# Altium schematic sheet PROC106B_HD_CONN_PWR_SW.SchDoc: BREAKAWAY_60PIN_CONN
size 431 x 279 mm; Date: Not shown in title block; ApprovedBy: Not shown in title block; CheckedBy: Not shown in title block; Author: Not shown in title block; CompanyName: Not shown in title block; DrawnBy: Antony/Anand Ram; Engineer: Not shown in title block; Organization: Not shown in title block; Address1: Not shown in title block; Address2: Not shown in title block; Address3: Not shown in title block; Address4: Not shown in title block; DocumentNumber: 7; Revision: Use project parameter SCH_Rev; SheetNumber: 7; SheetTotal: 12; PageSetup: Record=PageOptions|CenterHorizontal=True|CenterVertical=True|PrintScale=1.00|XCorrection=1.00|YCorrection=1.00|PrintKind=0|BorderSize=5000000|LeftOffset=0|BottomOffset=0|Orientation=2|PaperLength=1000|PaperWidth=1000|Scale=100|PaperSource=15|PrintQuality=600|MediaType=1|DitherType=10|PaperKind=Letter|PrintScaleMode=1; CurrentTime: Not shown in title block; CurrentDate: Not shown in title block; Time: Not shown in title block; DocumentFullPathAndName: Not shown in title block; DocumentName: Not shown in title block; ModifiedDate: Not shown in title block; ImagePath: Not shown in title block
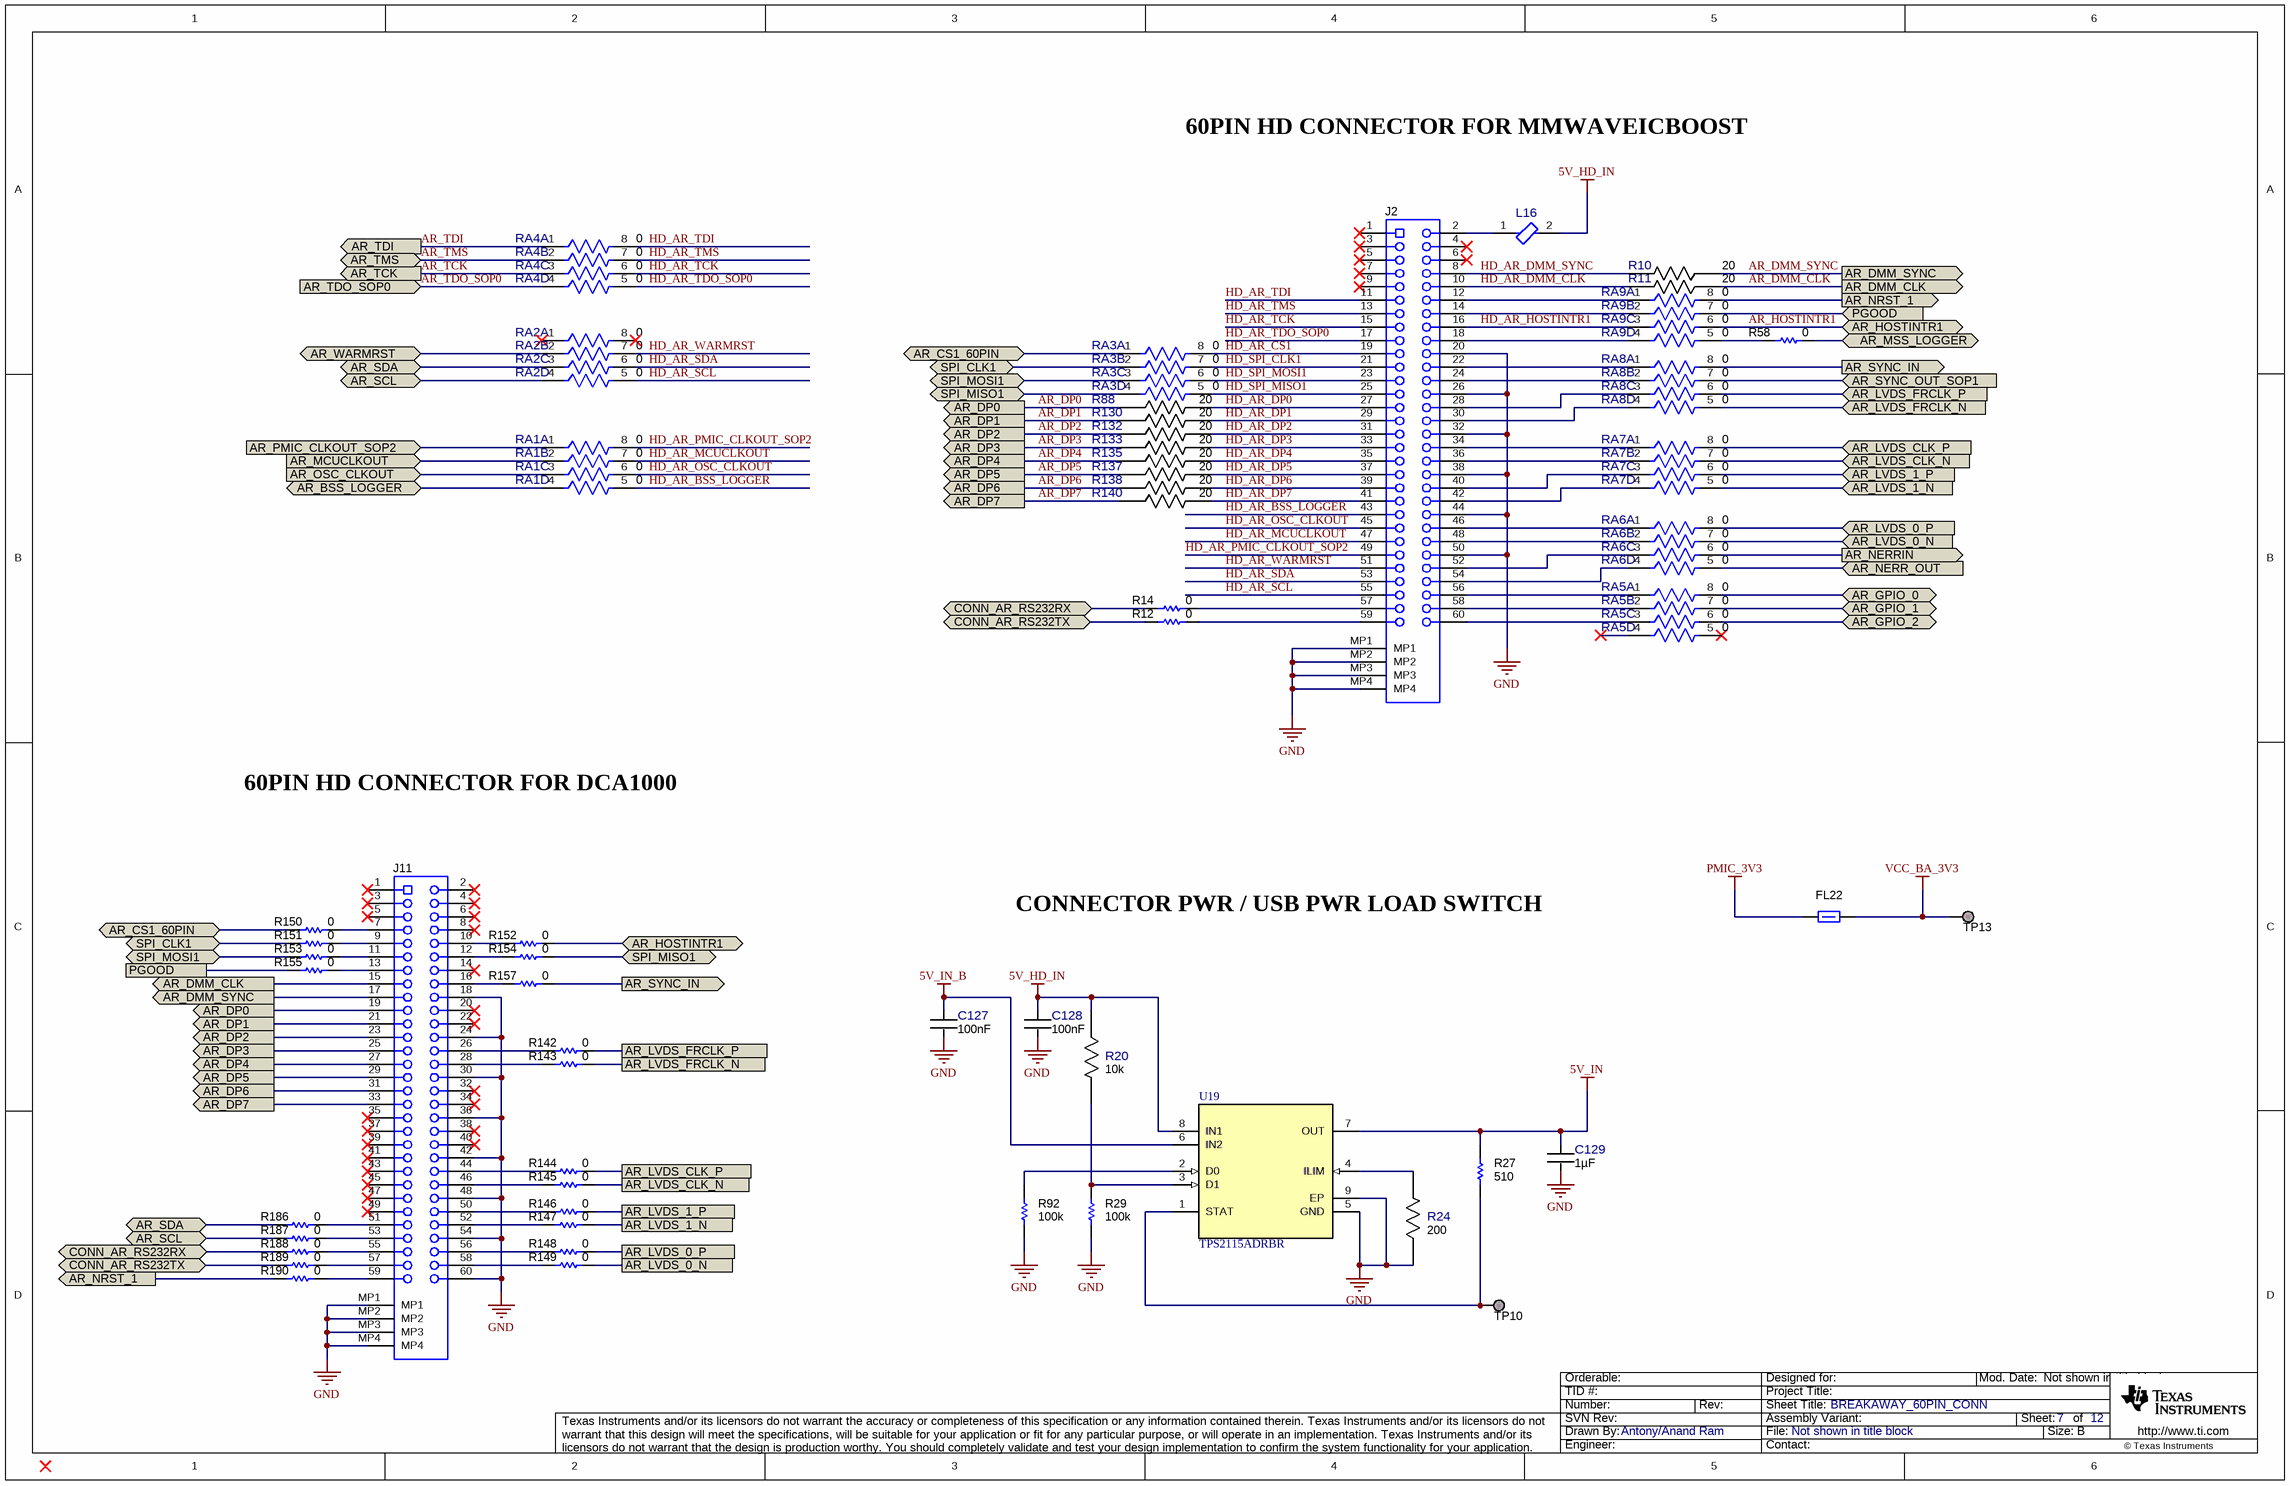
[diagram p0: PROC106B_HD_CONN_PWR_SW.SchDoc]

## Parts
C127  Cap_F: 100nF  [FP-GRM033R6YA104KE14D_0201 (0603 Metric)-IPC_C]  (hidden comment: GRM033R6YA104KE14D)
C128  Cap_F: 100nF  [FP-GRM033R6YA104KE14D_0201 (0603 Metric)-IPC_C]  (hidden comment: GRM033R6YA104KE14D)
C129  Cap_F: 1µF  [FP-CL03A105MO3NRNH_0201-IPC_C]  (hidden comment: CL03A105MO3NRNH)
FL22  BLM15PD300SZ1D  [0402L]  (value not drawn)
J2  QSH-030-01-L-D-A  [Samtec_QSH-030-01-X-D-A]  (value not drawn)
J11  QSH-030-01-L-D-A  [Samtec_QSH-030-01-X-D-A]  (value not drawn)
L16  MPZ2012S101ATD25  [FP-MPZ2012S101ATD25_0805-MFG]  (value not drawn)
R10  Res_ohm: 20  [FP-AC0201FR-0720RL_0201-IPC_C]  (hidden comment: AC0201FR-0720RL)
R11  Res_ohm: 20  [FP-AC0201FR-0720RL_0201-IPC_C]  (hidden comment: AC0201FR-0720RL)
R12  Res_ohm: 0  [FP-RC0201JR-070RL_0201 (0603 Metric)-MFG]  (hidden comment: RC0201JR-070RL)
R14  Res_ohm: 0  [FP-RC0201JR-070RL_0201 (0603 Metric)-MFG]  (hidden comment: RC0201JR-070RL)
R20  Res_ohm: 10k  [FP-RR0306P-103-D_0201-IPC_C]  (hidden comment: RR0306P-103-D)
R24  Res_ohm: 200  [FP-CRCW0402200RFKEDHP_0402-IPC_C]  (hidden comment: CRCW0402200RFKEDHP)
R27  value 510  [0201L]  (hidden comment: RC0201JR-07510RL)
R29  value 100k  [0201L]  (hidden comment: CRCW0201100KFKED)
R58  Res_ohm: 0  [FP-RC0201JR-070RL_0201 (0603 Metric)-MFG]  (hidden comment: RC0201JR-070RL)
R88  Res_ohm: 20  [FP-AC0201FR-0720RL_0201-IPC_C]  (hidden comment: AC0201FR-0720RL)
R92  value 100k  [0201L]  (hidden comment: CRCW0201100KFKED)
R130  Res_ohm: 20  [FP-AC0201FR-0720RL_0201-IPC_C]  (hidden comment: AC0201FR-0720RL)
R132  Res_ohm: 20  [FP-AC0201FR-0720RL_0201-IPC_C]  (hidden comment: AC0201FR-0720RL)
R133  Res_ohm: 20  [FP-AC0201FR-0720RL_0201-IPC_C]  (hidden comment: AC0201FR-0720RL)
R135  Res_ohm: 20  [FP-AC0201FR-0720RL_0201-IPC_C]  (hidden comment: AC0201FR-0720RL)
R137  Res_ohm: 20  [FP-AC0201FR-0720RL_0201-IPC_C]  (hidden comment: AC0201FR-0720RL)
R138  Res_ohm: 20  [FP-AC0201FR-0720RL_0201-IPC_C]  (hidden comment: AC0201FR-0720RL)
R140  Res_ohm: 20  [FP-AC0201FR-0720RL_0201-IPC_C]  (hidden comment: AC0201FR-0720RL)
R142  Res_ohm: 0  [FP-RC0201JR-070RL_0201 (0603 Metric)-MFG]  (hidden comment: RC0201JR-070RL)
R143  Res_ohm: 0  [FP-RC0201JR-070RL_0201 (0603 Metric)-MFG]  (hidden comment: RC0201JR-070RL)
R144  Res_ohm: 0  [FP-RC0201JR-070RL_0201 (0603 Metric)-MFG]  (hidden comment: RC0201JR-070RL)
R145  Res_ohm: 0  [FP-RC0201JR-070RL_0201 (0603 Metric)-MFG]  (hidden comment: RC0201JR-070RL)
R146  Res_ohm: 0  [FP-RC0201JR-070RL_0201 (0603 Metric)-MFG]  (hidden comment: RC0201JR-070RL)
R147  Res_ohm: 0  [FP-RC0201JR-070RL_0201 (0603 Metric)-MFG]  (hidden comment: RC0201JR-070RL)
R148  Res_ohm: 0  [FP-RC0201JR-070RL_0201 (0603 Metric)-MFG]  (hidden comment: RC0201JR-070RL)
R149  Res_ohm: 0  [FP-RC0201JR-070RL_0201 (0603 Metric)-MFG]  (hidden comment: RC0201JR-070RL)
R150  Res_ohm: 0  [FP-RC0201JR-070RL_0201 (0603 Metric)-MFG]  (hidden comment: RC0201JR-070RL)
R151  Res_ohm: 0  [FP-RC0201JR-070RL_0201 (0603 Metric)-MFG]  (hidden comment: RC0201JR-070RL)
R152  Res_ohm: 0  [FP-RC0201JR-070RL_0201 (0603 Metric)-MFG]  (hidden comment: RC0201JR-070RL)
R153  Res_ohm: 0  [FP-RC0201JR-070RL_0201 (0603 Metric)-MFG]  (hidden comment: RC0201JR-070RL)
R154  Res_ohm: 0  [FP-RC0201JR-070RL_0201 (0603 Metric)-MFG]  (hidden comment: RC0201JR-070RL)
R155  Res_ohm: 0  [FP-RC0201JR-070RL_0201 (0603 Metric)-MFG]  (hidden comment: RC0201JR-070RL)
R157  Res_ohm: 0  [FP-RC0201JR-070RL_0201 (0603 Metric)-MFG]  (hidden comment: RC0201JR-070RL)
R186  Res_ohm: 0  [FP-RC0201JR-070RL_0201 (0603 Metric)-MFG]  (hidden comment: RC0201JR-070RL)
R187  Res_ohm: 0  [FP-RC0201JR-070RL_0201 (0603 Metric)-MFG]  (hidden comment: RC0201JR-070RL)
R188  Res_ohm: 0  [FP-RC0201JR-070RL_0201 (0603 Metric)-MFG]  (hidden comment: RC0201JR-070RL)
R189  Res_ohm: 0  [FP-RC0201JR-070RL_0201 (0603 Metric)-MFG]  (hidden comment: RC0201JR-070RL)
R190  Res_ohm: 0  [FP-RC0201JR-070RL_0201 (0603 Metric)-MFG]  (hidden comment: RC0201JR-070RL)
RA1  Res_ohm: 0  [FP-EXB-18VR000X_0502-MFG]  (hidden comment: EXB-18VR000X)  (parts A,B,C,D of 4)
RA2  Res_ohm: 0  [FP-EXB-18VR000X_0502-MFG]  (hidden comment: EXB-18VR000X)  (parts A,B,C,D of 4)
RA3  Res_ohm: 0  [FP-EXB-18VR000X_0502-MFG]  (hidden comment: EXB-18VR000X)  (parts A,B,C,D of 4)
RA4  Res_ohm: 0  [FP-EXB-18VR000X_0502-MFG]  (hidden comment: EXB-18VR000X)  (parts A,B,C,D of 4)
RA5  Res_ohm: 0  [FP-EXB-18VR000X_0502-MFG]  (hidden comment: EXB-18VR000X)  (parts A,B,C,D of 4)
RA6  Res_ohm: 0  [FP-EXB-18VR000X_0502-MFG]  (hidden comment: EXB-18VR000X)  (parts A,B,C,D of 4)
RA7  Res_ohm: 0  [FP-EXB-18VR000X_0502-MFG]  (hidden comment: EXB-18VR000X)  (parts A,B,C,D of 4)
RA8  Res_ohm: 0  [FP-EXB-18VR000X_0502-MFG]  (hidden comment: EXB-18VR000X)  (parts A,B,C,D of 4)
RA9  Res_ohm: 0  [FP-EXB-18VR000X_0502-MFG]  (hidden comment: EXB-18VR000X)  (parts A,B,C,D of 4)
TP10  TESTPOINT  [TP_25MIL-SMT]  (value not drawn)  (no BOM)
TP13  TESTPOINT  [TP_25MIL-SMT]  (value not drawn)  (no BOM)
U19  TPS2115ADRBR  [DRB0008B]

## Ports
AR_BSS_LOGGER (bidir), AR_CS1_60PIN (bidir), AR_DMM_CLK (out), AR_DMM_SYNC (out), AR_DP0 (out), AR_DP1 (out), AR_DP2 (out), AR_DP3 (out), AR_DP4 (out), AR_DP5 (out), AR_DP6 (out), AR_DP7 (out), AR_GPIO_0 (bidir), AR_GPIO_1 (bidir), AR_GPIO_2 (bidir), AR_HOSTINTR1 (bidir), AR_LVDS_0_N, AR_LVDS_0_N (in), AR_LVDS_0_P, AR_LVDS_0_P (in), AR_LVDS_1_N, AR_LVDS_1_N (in), AR_LVDS_1_P, AR_LVDS_1_P (in), AR_LVDS_CLK_N, AR_LVDS_CLK_N (in), AR_LVDS_CLK_P, AR_LVDS_CLK_P (in), AR_LVDS_FRCLK_N, AR_LVDS_FRCLK_N (in), AR_LVDS_FRCLK_P, AR_LVDS_FRCLK_P (in), AR_MCUCLKOUT (in), AR_MSS_LOGGER (bidir), AR_NERR_OUT (in), AR_NERRIN (out), AR_NRST_1 (out), AR_OSC_CLKOUT (in), AR_PMIC_CLKOUT_SOP2 (in), AR_SCL (bidir), AR_SDA (bidir), AR_SYNC_IN (out), AR_SYNC_OUT_SOP1 (in), AR_TCK (out), AR_TDI (out), AR_TDO_SOP0 (in), AR_TMS (bidir), AR_WARMRST (bidir), CONN_AR_RS232RX (bidir), CONN_AR_RS232TX (bidir), PGOOD, PGOOD (in), SPI_CLK1 (bidir), SPI_MISO1 (bidir), SPI_MOSI1 (bidir)

## Nets
5V_HD_IN: C128.1 L16.2 R20.1 U19.8(IN1)
5V_IN: C129.1 R27.1 U19.7(OUT)
5V_IN_B: C127.1 U19.6(IN2)
GND: C127.2 C128.2 C129.2 J2.20 J2.26 J2.32 J2.38 J2.44 J2.50 J2.MP1 J2.MP2 J2.MP3 J2.MP4 J11.18 J11.24 J11.30 J11.36 J11.42 J11.48 J11.54 J11.60 J11.MP1 J11.MP2 J11.MP3 J11.MP4 R24.1 R29.1 R92.2 U19.5(GND) U19.9(EP)
PMIC_3V3: FL22.1
VCC_BA_3V3: FL22.2 TP13.1
AR_BSS_LOGGER: RA1.4 ; port AR_BSS_LOGGER
AR_CS1_60PIN: R150.2 RA3.1 ; port AR_CS1_60PIN
AR_DMM_CLK: J11.15 R11.1 ; port AR_DMM_CLK
AR_DMM_SYNC: J11.17 R10.1 ; port AR_DMM_SYNC
AR_DP0: J11.19 R88.1 ; port AR_DP0
AR_DP1: J11.21 R130.1 ; port AR_DP1
AR_DP2: J11.23 R132.1 ; port AR_DP2
AR_DP3: J11.25 R133.1 ; port AR_DP3
AR_DP4: J11.27 R135.1 ; port AR_DP4
AR_DP5: J11.29 R137.1 ; port AR_DP5
AR_DP6: J11.31 R138.1 ; port AR_DP6
AR_DP7: J11.33 R140.1 ; port AR_DP7
AR_GPIO_0: RA5.8 ; port AR_GPIO_0
AR_GPIO_1: RA5.7 ; port AR_GPIO_1
AR_GPIO_2: RA5.6 ; port AR_GPIO_2
AR_HOSTINTR1: R152.1 RA9.6 ; port AR_HOSTINTR1
AR_LVDS_0_N: R149.1 RA6.7 ; port AR_LVDS_0_N
AR_LVDS_0_P: R148.1 RA6.8 ; port AR_LVDS_0_P
AR_LVDS_1_N: R147.1 RA7.5 ; port AR_LVDS_1_N
AR_LVDS_1_P: R146.1 RA7.6 ; port AR_LVDS_1_P
AR_LVDS_CLK_N: R145.1 RA7.7 ; port AR_LVDS_CLK_N
AR_LVDS_CLK_P: R144.1 RA7.8 ; port AR_LVDS_CLK_P
AR_LVDS_FRCLK_N: R143.1 RA8.5 ; port AR_LVDS_FRCLK_N
AR_LVDS_FRCLK_P: R142.1 RA8.6 ; port AR_LVDS_FRCLK_P
AR_MCUCLKOUT: RA1.2 ; port AR_MCUCLKOUT
AR_MSS_LOGGER: R58.1 ; port AR_MSS_LOGGER
AR_NERR_OUT: RA6.5 ; port AR_NERR_OUT
AR_NERRIN: RA6.6 ; port AR_NERRIN
AR_NRST_1: R190.2 RA9.8 ; port AR_NRST_1
AR_OSC_CLKOUT: RA1.3 ; port AR_OSC_CLKOUT
AR_PMIC_CLKOUT_SOP2: RA1.1 ; port AR_PMIC_CLKOUT_SOP2
AR_SCL: R187.2 RA2.4 ; port AR_SCL
AR_SDA: R186.2 RA2.3 ; port AR_SDA
AR_SYNC_IN: R157.1 RA8.8 ; port AR_SYNC_IN
AR_SYNC_OUT_SOP1: RA8.7 ; port AR_SYNC_OUT_SOP1
AR_TCK: RA4.3 ; port AR_TCK
AR_TDI: RA4.1 ; port AR_TDI
AR_TDO_SOP0: RA4.4 ; port AR_TDO_SOP0
AR_TMS: RA4.2 ; port AR_TMS
AR_WARMRST: RA2.2 ; port AR_WARMRST
CONN_AR_RS232RX: R14.2 R188.2 ; port CONN_AR_RS232RX
CONN_AR_RS232TX: R12.2 R189.2 ; port CONN_AR_RS232TX
HD_AR_BSS_LOGGER: J2.43 RA1.5
HD_AR_CS1: J2.19 RA3.8
HD_AR_DMM_CLK: J2.10 R11.2
HD_AR_DMM_SYNC: J2.8 R10.2
HD_AR_DP0: J2.27 R88.2
HD_AR_DP1: J2.29 R130.2
HD_AR_DP2: J2.31 R132.2
HD_AR_DP3: J2.33 R133.2
HD_AR_DP4: J2.35 R135.2
HD_AR_DP5: J2.37 R137.2
HD_AR_DP6: J2.39 R138.2
HD_AR_DP7: J2.41 R140.2
HD_AR_HOSTINTR1: J2.16 RA9.3
HD_AR_MCUCLKOUT: J2.47 RA1.7
HD_AR_OSC_CLKOUT: J2.45 RA1.6
HD_AR_PMIC_CLKOUT_SOP2: J2.49 RA1.8
HD_AR_SCL: J2.55 RA2.5
HD_AR_SDA: J2.53 RA2.6
HD_AR_TCK: J2.15 RA4.6
HD_AR_TDI: J2.11 RA4.8
HD_AR_TDO_SOP0: J2.17 RA4.5
HD_AR_TMS: J2.13 RA4.7
HD_AR_WARMRST: J2.51 RA2.7
HD_SPI_CLK1: J2.21 RA3.7
HD_SPI_MISO1: J2.25 RA3.5
HD_SPI_MOSI1: J2.23 RA3.6
PGOOD: R155.2 RA9.7 ; port PGOOD
SPI_CLK1: R151.2 RA3.2 ; port SPI_CLK1
SPI_MISO1: R154.1 RA3.4 ; port SPI_MISO1
SPI_MOSI1: R153.2 RA3.3 ; port SPI_MOSI1
NetJ2_2: J2.2 L16.1
NetJ2_12: J2.12 RA9.1
NetJ2_14: J2.14 RA9.2
NetJ2_18: J2.18 RA9.4
NetJ2_22: J2.22 RA8.1
NetJ2_24: J2.24 RA8.2
NetJ2_28: J2.28 RA8.3
NetJ2_30: J2.30 RA8.4
NetJ2_34: J2.34 RA7.1
NetJ2_36: J2.36 RA7.2
NetJ2_40: J2.40 RA7.3
NetJ2_42: J2.42 RA7.4
NetJ2_46: J2.46 RA6.1
NetJ2_48: J2.48 RA6.2
NetJ2_52: J2.52 RA6.3
NetJ2_54: J2.54 RA6.4
NetJ2_56: J2.56 RA5.1
NetJ2_57: J2.57 R14.1
NetJ2_58: J2.58 RA5.2
NetJ2_59: J2.59 R12.1
NetJ2_60: J2.60 RA5.3
NetJ11_7: J11.7 R150.1
NetJ11_9: J11.9 R151.1
NetJ11_10: J11.10 R152.2
NetJ11_11: J11.11 R153.1
NetJ11_12: J11.12 R154.2
NetJ11_13: J11.13 R155.1
NetJ11_16: J11.16 R157.2
NetJ11_26: J11.26 R142.2
NetJ11_28: J11.28 R143.2
NetJ11_44: J11.44 R144.2
NetJ11_46: J11.46 R145.2
NetJ11_50: J11.50 R146.2
NetJ11_51: J11.51 R186.1
NetJ11_52: J11.52 R147.2
NetJ11_53: J11.53 R187.1
NetJ11_55: J11.55 R188.1
NetJ11_56: J11.56 R148.2
NetJ11_57: J11.57 R189.1
NetJ11_58: J11.58 R149.2
NetJ11_59: J11.59 R190.1
NetR20_2: R20.2 R29.2 U19.3(D1)
NetR24_2: R24.2 U19.4(ILIM)
NetR27_2: R27.2 TP10.1 U19.1(STAT)
NetR58_2: R58.2 RA9.5
NetR92_1: R92.1 U19.2(D0)

Not connected (* = marked no-connect by the designer): J2 1* 3* 4* 5* 6* 7* 9*; J11 1* 2* 3* 4* 5* 6* 8* 14* 20* 22* 32* 34* 35* 37* 38* 39* 40* 41* 43* 45* 47* 49*; RA2 1* 8*; RA5 4* 5*

## Notes on the sheet
- 60PIN HD CONNECTOR FOR MMWAVEICBOOST
- 60PIN HD CONNECTOR FOR DCA1000
- CONNECTOR PWR / USB PWR LOAD SWITCH
- Drawn By:
- SVN Rev:
- Number:
- TID #:
- Orderable:
- Rev:
- Sheet Title:
- File:
- Project Title:
- Designed for:
- Assembly Variant:
- Mod. Date:
- Sheet:
- Size:
- of
- B
- http://www.ti.com
- Texas Instruments and/or its licensors do not warrant the accuracy or completeness of this specification or any information contained therein. Texas Instruments and/or its licensors do not warrant that this design will meet the specifications, will be suitable for your application or fit for any particular purpose, or will operate in an implementation. Texas Instruments and/or its licensors do not warrant that the design is production worthy. You should completely validate and test your design implementation to confirm the system functionality for your application.
- Engineer:
- Contact:
- © Texas Instruments

## Library data of the parts
C127 C128 = CMP-0086440-1: Cap Ceramic 0.1uF 35V X5R 10% Pad SMD 0201 85C T/R; Manufacturer: Murata Electronics North America; AEC Qualified: No; SizeZ_mm: 0.33mm; Symbol Name: SYM-GRM033R6YA104KE14D; TempCo: 15%; RoHS: TRUE; ComponentLink1Description: Datasheet; ComponentLink1URL: https://search.murata.co.jp/Ceramy/image/img/A01X/G101/ENG/GRM033R6YA104KE14-01.pdf; PackageReference: 0201 (0603 Metric); PartNumber: GRM033R6YA104KE14D; Tolerance_%: 10%; VDC_V: 35V
C129 = CMP-0086446-1: 1µF ±20% 16V Ceramic Capacitor X5R 0201; Manufacturer: Samsung Electro-Mechanics; AEC Qualified: No; SizeZ_mm: 0.39mm; Symbol Name: SYM-CL03A105MO3NRNH; TempCo: 15%; RoHS: TRUE; ComponentLink1Description: Datasheet; ComponentLink1URL: http://www.samsungsem.com/global/front/downloadcms.do?path=%2F%2Fglobal%2F%2Fsupport%2F%2Fproduct-search%2F%2Fmlcc%2F%2F__icsFiles%2F%2Fafieldfile%2F%2F2018%2F%2F06%2F%2F21&fileName=CL03A105MO3NRNH.pdf; PackageReference: 0201; PartNumber: CL03A105MO3NRNH; Tolerance_%: 20%; VDC_V: 16V
FL22 = CMP-0078934-1: Inductor, Ferrite Bead, Ferrite, 2.2 A, 0.035 ohm, AEC-Q200 Grade 1, SMD; Manufacturer: MuRata; AEC Category: Q200; AEC Grade: 1; AEC Qualified: Y; DCR_ohm: 0.035; Imax_A: 2.2A; SizeArea_mm2: 0.5; SizeAreaWB_mm2: 3; SizeZ_mm: 0.6; RoHS: Y; ComponentLink1Description: Datasheet link; ComponentLink1URL: https://www.murata.com/en-us/products/productdata/8796748677150/QNFA9118.pdf; CompType: Inductor; LatestRevisionDate: 2017-12-07; Material: Ferrite; MountType: SMT; PackageReference: 0402; PartNumber: BLM15PD300SZ1D; Published: 2008-06-26; Publisher: Texas Instruments; SizeX_mm: 1; SizeY_mm: 0.5; Supplier 1: Digi-Key; Supplier 2: Mouser; Supplier Part Number 1: 490-16506-1-ND; Supplier Part Number 2: 81-BLM15PD300SZ1D; Technology: Ferrite Bead; Value1: 0.035 ohm; Value2: 2.2A
J2 J11 = CMP-0075524-1: Receptacle, 0.5 mm, 30x2, Gold, TH; Manufacturer: Samtec; Pitch_mm: 0.5; Gender: Female; Green_REACh: Passed; CT: False; Shrouded: N; RowSpacing_mm: 5.73; Green_Lifecycle: Active; Row_Count: 2; ComponentLink1Description: Datasheet URL; RoHS: Y; Supplier Part Number 3: 1667876; Supplier 1: Digi-Key; Orientation: Vertical; Green_EU RoHS: Passed with Exemption; PackageReference: Receptacle, 0.5 mm, 30x2, TH; Color: Black; PartNumber: QSH-030-01-L-D-A; PinCount: 60; Publisher: Texas Instruments; Supplier Part Number 2: 19M9181; ContactFinish: Gold; Supplier 2: Newark; ComponentLink1URL: http://www.samtec.com/ftppub/cpdf/QSH-XXX-01-X-D-XX-MKT.pdf; LatestRevisionDate: 2017-07-12; CompType: Receptacle; CNHeader: False; MountType: SMT; Supplier Part Number 1: SAM8180-ND; Supplier 3: Farnell; Green_EU RoHS-2: Passed
L16 = CMP-0089947-1: 100 Ohms @ 100MHz 1 Power Line Ferrite Bead 0805 (2012 Metric) 4A 20mOhm; Manufacturer: TDK; DCR_ohm: 0.02; SizeZ_mm: 1.05mm; AEC Grade: Grade 1; AEC Qualified: Yes; Impedance At Frequency: 100Ω @ 100MHz; Tolerance_%: 25%; ComponentLink1URL: https://product.tdk.com/info/en/catalog/datasheets/beads_automotive_power_mpz2012_en.pdf; Supplier Part Number 2: 810-MPZ2012S101ATD25; Supplier 2: Mouser; RoHS: TRUE; Supplier 1: Digikey; PackageReference: 0805; Imax_A: 4A; PartNumber: MPZ2012S101ATD25; ComponentLink1Description: Datasheet; Supplier Part Number 1: 445-172903-1-ND; datasheet: https://product.tdk.com/info/en/catalog/datasheets/beads_automotive_power_mpz2012_en.pdf; Datasheet Path: datasheets/FBead-MPZ2012S101ATD25.pdf; Digikey Description: FERRITE BEAD 100 OHM 0805 1LN; Digikey Part Number: 445-172903-1-ND; helpURL: https://upverter.com/upn/revision/572b4800072287ce/; Lead Free: Yes; Material: Ferrite; Mouser Description: Ferrite Beads 0805 100ohms@100MHz 4.0A AEC-Q200; Mouser Part Number: 810-MPZ2012S101ATD25; Operating Temperature Range: -55°C to +125°C; Part Number: MPZ2012S101ATD25; Test Frequency: 100MHz
R10 R11 R88 R130 R132 R133 R135 R137 R138 R140 = CMP-0087185-1: RES SMD 20 OHM 1% 1/20W 0201; Manufacturer: Yageo; AEC Grade: Grade 0; AEC Qualified: Yes; Power_W: 50mW; SizeZ_mm: 0.26mm; Symbol Name: SYM-AC0201FR-0720RL; TempCo: 200ppm/°C; VDC_V: 25V; RoHS: TRUE; ComponentLink1Description: Datasheet; ComponentLink1URL: http://www.yageo.com/NewPortal/yageodocoutput?fileName=/pdf/R-Chip/PYu-AC_51_RoHS_L_6.pdf; PackageReference: 0201; PartNumber: AC0201FR-0720RL; Technology: Thick Film; Tolerance_%: 1%
R12 R14 R58 R142-R155 R157 R186-R190 = CMP-0086442-2: RES SMD 0 OHM JUMPER 1/20W 0201; Manufacturer: Yageo; AEC Qualified: No; Power_W: 50mW; SizeZ_mm: 0.26mm; TempCo: 200ppm/°C; Tolerance_%: 5%; VDC_V: 25V; RoHS: TRUE; ComponentLink1Description: Datasheet; ComponentLink1URL: http://www.yageo.com/documents/recent/PYu-RC_Group_51_RoHS_L_10.pdf; PackageReference: 0201 (0603 Metric); PartNumber: RC0201JR-070RL; Technology: Thick Film
R20 = CMP-0088002-1: 10 kOhms ±0.5% 0.05W, 1/20W Chip Resistor 0201 (0603 Metric)  Thin Film; Manufacturer: Susumu; AEC Qualified: No; Power_W: 50mW; SizeZ_mm: 0.26mm; Symbol Name: SYM-RR0306P-103-D; TempCo: 25ppm/°C; VDC_V: 15V; RoHS: TRUE; ComponentLink1Description: Datasheet; ComponentLink1URL: https://www.susumu.co.jp/common/pdf/n_catalog_partition05_en.pdf; PackageReference: 0201; PartNumber: RR0306P-103-D; Technology: Thin Film; Tolerance_%: 0.5%
R24 = CMP-0087183-1: RES SMD 200 OHM 1% 1/5W 0402; Manufacturer: Vishay Dale; AEC Grade: Grade 0; AEC Qualified: Yes; Power_W: 200mW; SizeZ_mm: 0.4mm; Symbol Name: SYM-CRCW0402200RFKEDHP; TempCo: 100ppm/°C; VDC_V: 50V; RoHS: TRUE; ComponentLink1Description: Datasheet; ComponentLink1URL: http://www.vishay.com/docs/20043/crcwhpe3.pdf; PackageReference: 0402; PartNumber: CRCW0402200RFKEDHP; Technology: Thick Film; Tolerance_%: 1%
R27 = CMP-0027137-1: RES, 510, 5%, 0.05 W, 0201; Manufacturer: Yageo America; AEC Category: Q200; AEC Qualified: N; EIA_Code: E24; Power_W: 50mW; SizeArea_mm2: 0.18; SizeX_mm: 0.6; SizeY_mm: 0.3; SizeZ_mm: 0.26; TempCo: 200 ppm/C; U/M: EA; Value2: 0.05W; Value_Code: 510R; VDC_V: 25V; RoHS: Y; AEC Grade: N/A; ComponentLink1Description: Datasheet link; ComponentLink1URL: http://www.yageo.com/documents/recent/PYu-RC_Group_51_RoHS_L_5.pdf; CompType: Resistor; LatestRevisionDate: 2017-03-09; MountType: SMT; PackageReference: 0201; PartNumber: RC0201JR-07510RL; Published: 2016-10-14; Publisher: Texas Instruments; Res_ohm: 510; Supplier 1: Digi-Key; Supplier 2: Mouser; Supplier Part Number 1: YAG2907CT-ND; Supplier Part Number 2: 603-RC0201JR-07510RL; Technology: Thick Film; Tolerance_%: 5%; Value1: 5%; ValueDisplayed: 510
R29 R92 = CMP-0027261-3: RES, 100 k, 1%, 0.05 W, 0201; Manufacturer: Vishay-Dale; AEC Category: Q200; AEC Qualified: N; EIA_Code: E96; Power_W: 50mW; SizeArea_mm2: 0.18; SizeX_mm: 0.6; SizeY_mm: 0.3; SizeZ_mm: 0.26; TempCo: 100 ppm/C; Value2: 0.05W; VDC_V: 30V; RoHS: E; AEC Grade: N/A; ComponentLink1Description: Datasheet link; ComponentLink1URL: http://www.vishay.com/docs/20052/crcw0201e3.pdf; CompType: Resistor; MountType: SMT; PackageReference: 0201; PartNumber: CRCW0201100KFKED; Res_ohm: 100k; Supplier 1: Digi-Key; Supplier 2: Newark; Supplier 3: Mouser; Supplier Part Number 1: 541-100KAABCT-ND; Supplier Part Number 2: 84R1457; Supplier Part Number 3: 71-CRCW0201100KFKED; Technology: Thick Film; Tolerance_%: 1%; Value1: 1%; Value_Code: 100k; ValueDisplayed: 100k
RA1-RA9 = CMP-0087186-1: RES ARRAY 4 RES ZERO OHM 0502; Manufacturer: Panasonic Electronic Components; AEC Qualified: No; Power_W: 100mW; SizeZ_mm: 0.45mm; TempCo: -200/+600ppm/°C; Tolerance_%: 5%; VDC_V: 12.5V; RoHS: TRUE; ComponentLink1Description: Datasheet; ComponentLink1URL: https://industrial.panasonic.com/cdbs/www-data/pdf/AOC0000/AOC0000C14.pdf; PackageReference: 0502; PartNumber: EXB-18VR000X; Symbol Name: SYM-EXB-18VR000X; Technology: Thick Film
TP10 TP13 = CMP-0078143-3: TEST POINT.  No entry in BOM.; CompType: Testpoint; Manufacturer: N/A; PackageReference: N/A; PartNumber: N/A; Library Reference: TESTPOINT
U19 = CMP-0043358-3: Dual In / Single Out Autoswitching Power Mux, 2.8 to 5.5 V, -40 to 85 degC, 8-pin SON (DRB), Green (RoHS & no Sb/Br); Manufacturer: Texas Instruments; AEC Category: Q200; AEC Qualified: N; CompType: IC; IN1, IN2 Input Voltage(Max)(V): 5.5; IN1, IN2 Input Voltage(Min)(V): 2.8; IN1 Output Current(Max)(A): 1.25; IN1 rDS(on)(Typ)(mOhm): 84; IN2 rDS(on)(Typ)(Ohms): 0.084; Number of Inputs: 2; SizeArea_mm2: 9.0; SizeAreaWB_mm2: 16.0; SizeX_mm: 3.0; SizeZ_mm: 1.0; SubFamily: Power Multiplexer (MUX); RoHS: Y; ComponentLink1Description: Datasheet; ComponentLink1URL: http://www.ti.com/general/docs/lit/getliterature.tsp?genericPartNumber=TPS2115A&fileType=pdf; DatasheetVersion: SBVS044F; Eco-Plan: Green (RoHS & no Sb/Br); IN2 Output Current(Max)(A): 1.25; MountType: SMT; PackageDescription: VSON-8; PackageReference: DRB0008B; PackageVersion: revK, Jun-2012; PartNumber: TPS2115ADRBR; SizeY_mm: 3.0